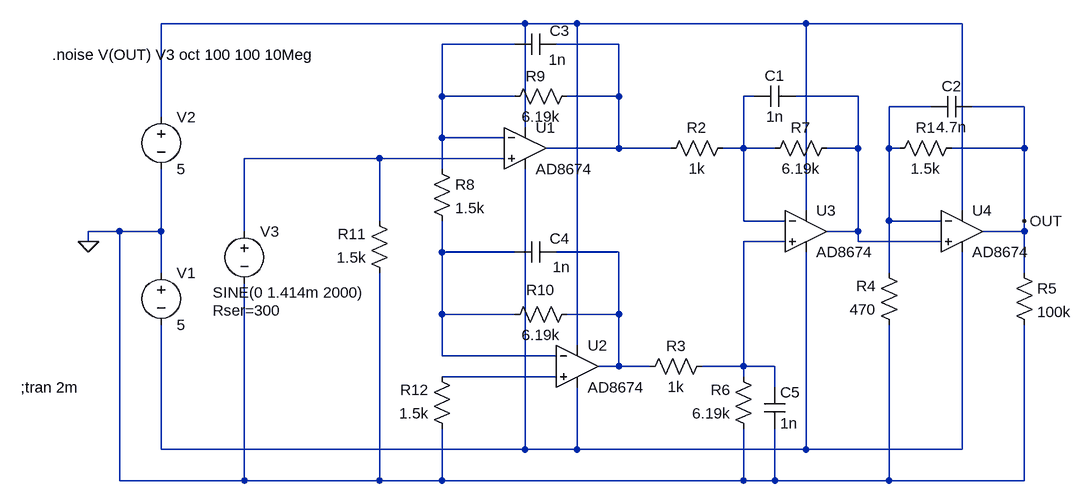
[diagram p0: schematic model1.asc]
model1.asc, the LTspice schematic file:
Version 4
SHEET 1 900 680
WIRE 48 -240 -512 -240
WIRE 128 -240 48 -240
WIRE 480 -240 128 -240
WIRE 720 -240 480 -240
WIRE 32 -208 -80 -208
WIRE 192 -208 96 -208
WIRE -80 -128 -80 -208
WIRE 32 -128 -80 -128
WIRE 192 -128 192 -208
WIRE 192 -128 112 -128
WIRE 400 -128 384 -128
WIRE 560 -128 464 -128
WIRE 672 -112 608 -112
WIRE 816 -112 736 -112
WIRE -512 -96 -512 -240
WIRE 48 -80 48 -240
WIRE -80 -64 -80 -128
WIRE 16 -64 -80 -64
WIRE 192 -48 192 -128
WIRE 192 -48 80 -48
WIRE 272 -48 192 -48
WIRE 384 -48 384 -128
WIRE 384 -48 352 -48
WIRE 432 -48 384 -48
WIRE 560 -48 560 -128
WIRE 560 -48 512 -48
WIRE 608 -48 608 -112
WIRE 624 -48 608 -48
WIRE 816 -48 816 -112
WIRE 816 -48 704 -48
WIRE -176 -32 -384 -32
WIRE 16 -32 -176 -32
WIRE -80 -16 -80 -64
WIRE 480 48 480 -240
WIRE 720 48 720 -240
WIRE -176 64 -176 -32
WIRE 384 64 384 -48
WIRE 448 64 384 64
WIRE 608 64 608 -48
WIRE 688 64 608 64
WIRE 816 64 816 -48
WIRE -576 80 -624 80
WIRE -512 80 -512 -16
WIRE -512 80 -576 80
WIRE -384 80 -384 -32
WIRE 560 80 560 -48
WIRE 560 80 512 80
WIRE 816 80 816 64
WIRE 816 80 752 80
WIRE -624 96 -624 80
WIRE 448 96 384 96
WIRE 560 96 560 80
WIRE 688 96 560 96
WIRE -80 112 -80 64
WIRE 32 112 -80 112
WIRE 192 112 96 112
WIRE -512 144 -512 80
WIRE 608 144 608 64
WIRE 816 144 816 80
WIRE -80 208 -80 112
WIRE 32 208 -80 208
WIRE 192 208 192 112
WIRE 192 208 112 208
WIRE 128 256 128 -240
WIRE -80 272 -80 208
WIRE 96 272 -80 272
WIRE 192 288 192 208
WIRE 192 288 160 288
WIRE 240 288 192 288
WIRE 384 288 384 96
WIRE 384 288 320 288
WIRE 432 288 384 288
WIRE 96 304 -80 304
WIRE 384 304 384 288
WIRE 432 320 432 288
WIRE -512 416 -512 224
WIRE 48 416 48 -16
WIRE 48 416 -512 416
WIRE 128 416 128 320
WIRE 128 416 48 416
WIRE 480 416 480 112
WIRE 480 416 128 416
WIRE 720 416 720 112
WIRE 720 416 480 416
WIRE -576 464 -576 80
WIRE -384 464 -384 160
WIRE -384 464 -576 464
WIRE -176 464 -176 144
WIRE -176 464 -384 464
WIRE -80 464 -80 384
WIRE -80 464 -176 464
WIRE 384 464 384 384
WIRE 384 464 -80 464
WIRE 432 464 432 384
WIRE 432 464 384 464
WIRE 608 464 608 224
WIRE 608 464 432 464
WIRE 816 464 816 224
WIRE 816 464 608 464
FLAG -624 96 0
FLAG 816 64 OUT
SYMBOL voltage -512 128 R0
WINDOW 123 0 0 Left 2
WINDOW 39 0 0 Left 2
SYMATTR InstName V1
SYMATTR Value 5
SYMBOL voltage -512 -112 R0
WINDOW 123 0 0 Left 2
WINDOW 39 0 0 Left 2
SYMATTR InstName V2
SYMATTR Value 5
SYMBOL res 720 -64 R90
WINDOW 0 0 56 VBottom 2
WINDOW 3 32 56 VTop 2
SYMATTR InstName R1
SYMATTR Value 1.5k
SYMBOL res 368 -64 R90
WINDOW 0 0 56 VBottom 2
WINDOW 3 32 56 VTop 2
SYMATTR InstName R2
SYMATTR Value 1k
SYMBOL res 336 272 R90
WINDOW 0 0 56 VBottom 2
WINDOW 3 32 56 VTop 2
SYMATTR InstName R3
SYMATTR Value 1k
SYMBOL res 624 240 R180
WINDOW 0 36 76 Left 2
WINDOW 3 36 40 Left 2
SYMATTR InstName R4
SYMATTR Value 470
SYMBOL res 800 128 R0
SYMATTR InstName R5
SYMATTR Value 100k
SYMBOL res 400 400 R180
WINDOW 0 36 76 Left 2
WINDOW 3 36 40 Left 2
SYMATTR InstName R6
SYMATTR Value 6.19k
SYMBOL res 416 -32 R270
WINDOW 0 32 56 VTop 2
WINDOW 3 0 56 VBottom 2
SYMATTR InstName R7
SYMATTR Value 6.19k
SYMBOL res 128 -144 R90
WINDOW 0 1 64 VBottom 2
WINDOW 3 32 56 VTop 2
SYMATTR InstName R9
SYMATTR Value 6.19k
SYMBOL res -160 160 R180
WINDOW 0 36 76 Left 2
WINDOW 3 36 40 Left 2
SYMATTR InstName R11
SYMATTR Value 1.5k
SYMBOL res -64 400 R180
WINDOW 0 36 76 Left 2
WINDOW 3 36 40 Left 2
SYMATTR InstName R12
SYMATTR Value 1.5k
SYMBOL res -96 -32 R0
SYMATTR InstName R8
SYMATTR Value 1.5k
SYMBOL voltage -384 64 R0
WINDOW 3 -49 110 Left 2
WINDOW 123 0 0 Left 2
WINDOW 39 -49 138 Left 2
SYMATTR Value SINE(0 1.414m 2000)
SYMATTR SpiceLine Rser=300
SYMATTR InstName V3
SYMBOL res 128 192 R90
WINDOW 0 -6 56 VBottom 2
WINDOW 3 32 56 VTop 2
SYMATTR InstName R10
SYMATTR Value 6.19k
SYMBOL cap 464 -144 R90
WINDOW 0 0 32 VBottom 2
WINDOW 3 32 32 VTop 2
SYMATTR InstName C1
SYMATTR Value 1n
SYMBOL cap 736 -128 R90
WINDOW 0 0 32 VBottom 2
WINDOW 3 32 32 VTop 2
SYMATTR InstName C2
SYMATTR Value 4.7n
SYMBOL cap 96 -224 R90
WINDOW 0 11 -5 VBottom 2
WINDOW 3 24 -2 VTop 2
SYMATTR InstName C3
SYMATTR Value 1n
SYMBOL cap 96 96 R90
WINDOW 0 11 -5 VBottom 2
WINDOW 3 23 -8 VTop 2
SYMATTR InstName C4
SYMATTR Value 1n
SYMBOL Opamps\\AD8674 48 -112 R0
SYMATTR InstName U1
SYMBOL Opamps\\AD8674 128 224 R0
SYMATTR InstName U2
SYMBOL Opamps\\AD8674 480 16 R0
SYMATTR InstName U3
SYMBOL Opamps\\AD8674 720 16 R0
SYMATTR InstName U4
SYMBOL cap 416 320 R0
SYMATTR InstName C5
SYMATTR Value 1n
TEXT -728 320 Left 2 !;tran 2m
TEXT -680 -192 Left 2 !.noise V(OUT) V3 oct 100 100 10Meg

The netlist it stands for:
* model1.asc
V1 0 N012 5
V2 N001 0 5
R1 OUT N006 1.5k
R2 N004 N003 1k
R3 N008 N010 1k
R4 0 N006 470
R5 OUT 0 100k
R6 0 N008 6.19k
R7 N004 N005 6.19k
R9 N003 N002 6.19k
R11 0 N007 1.5k
R12 0 N011 1.5k
R8 N002 N009 1.5k
V3 N007 0 SINE(0 1.414m 2000) Rser=300
R10 N010 N009 6.19k
C1 N005 N004 1n
C2 OUT N006 4.7n
C3 N003 N002 1n
C4 N010 N009 1n
XU1 N007 N002 N001 N012 N003 AD8674  ; pins In+ In- V+ V- OUT
XU2 N011 N009 N001 N012 N010 AD8674  ; pins In+ In- V+ V- OUT
XU3 N008 N004 N001 N012 N005 AD8674  ; pins In+ In- V+ V- OUT
XU4 N005 N006 N001 N012 OUT AD8674  ; pins In+ In- V+ V- OUT
C5 N008 0 1n
;tran 2m
.noise V(OUT) V3 oct 100 100 10Meg
.backanno
.end